# Altium schematic sheet 03_Power_260316_V02.SchDoc
size A3
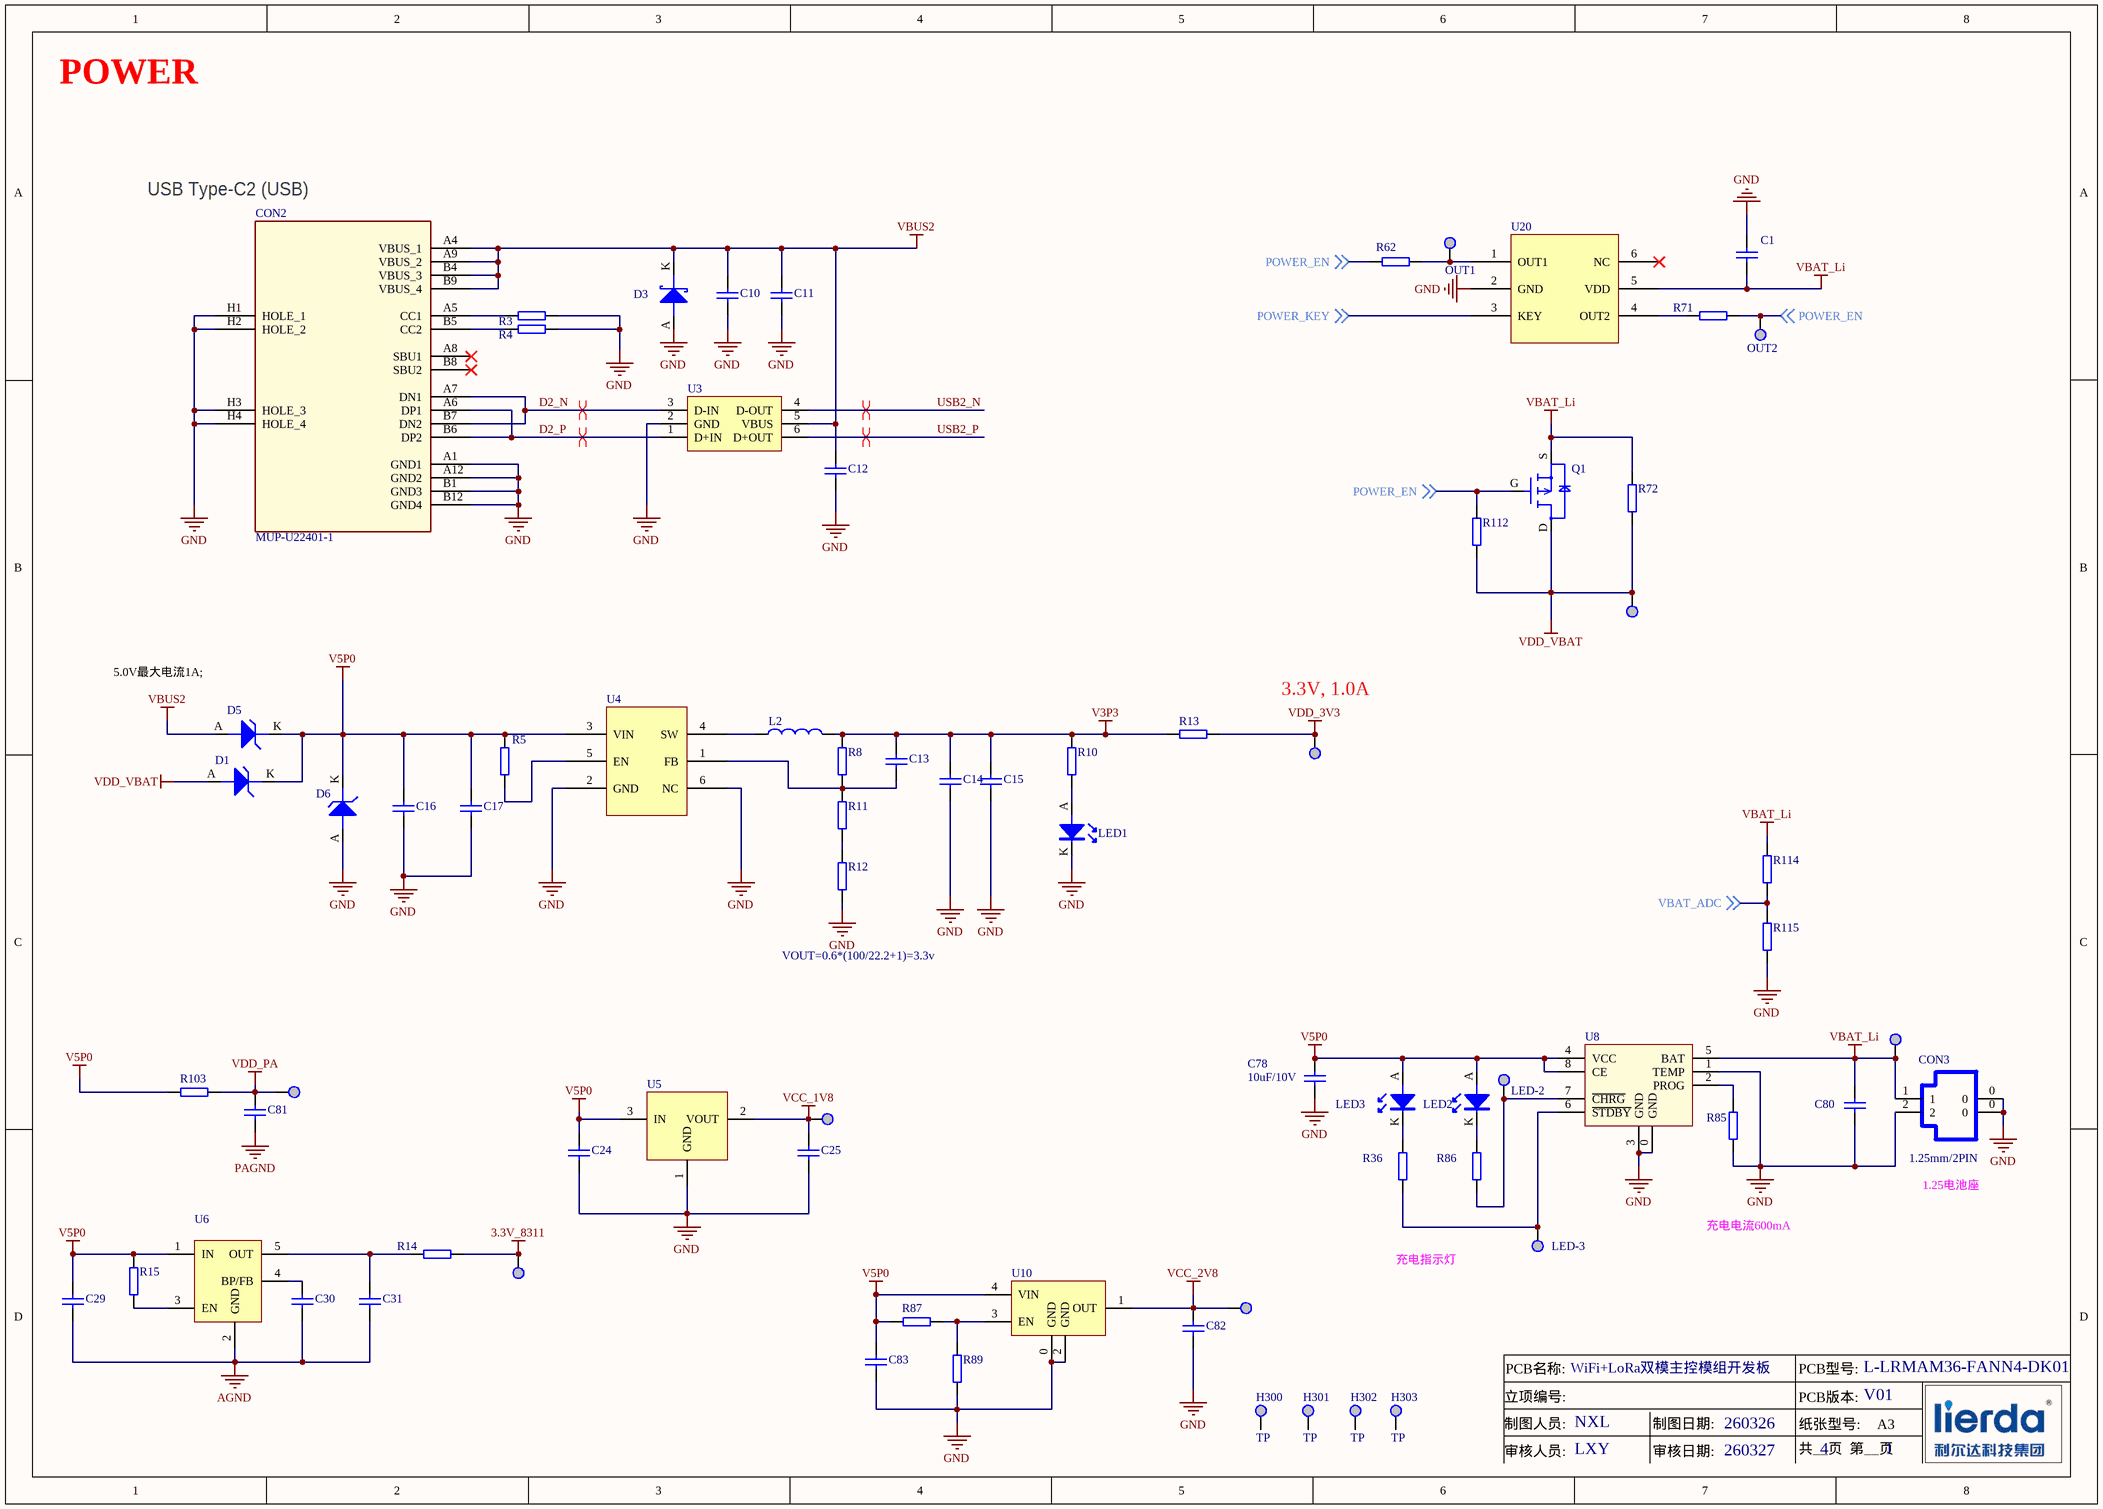
[diagram p0: 03_Power_260316_V02.SchDoc]

## Parts
C1  2.2uF  [0402C_0.4D]  (value not drawn)
C10  4.7uF/16V  [0402C_0.4D]  (value not drawn)
C11  0.1uF/16V  [0402C_0.4D]  (value not drawn)
C12  0.1uF  [0402C_0.4D]  (value not drawn)
C13  20pF  [0402C_0.4D]  (value not drawn)
C14  22uF  [0603C_0.6D]  (value not drawn)
C15  10uF/10V  [0402C_0.4D]  (value not drawn)
C16  4.7uF/16V  [0402C_0.4D]  (value not drawn)
C17  1uF/16V  [0402C_0.4D]  (value not drawn)
C24  1uF/16V  [0402C_0.4D]  (value not drawn)
C25  1uF/16V  [0402C_0.4D]  (value not drawn)
C29  1uF/16V  [0402C_0.4D]  (value not drawn)
C30  10nF  [0402C_0.4D]  (value not drawn)
C31  1uF/16V  [0402C_0.4D]  (value not drawn)
C78  产品型号: 10uF/10V  [0402C_0.4D]  (hidden comment: CAP-NP)
C80  CAP-NP  [0402C_0.4D]  (value not drawn)
C81  10uF/10V  [0402C_0.4D]  (value not drawn)
C82  1uF/16V  [0402C_0.4D]  (value not drawn)
C83  2.2uF  [0402C_0.4D]  (value not drawn)
CON2  产品型号: MUP-U22401-1  [USB-TYPEC-U22401-1]  (hidden comment: USB-TYPE C-16)
CON3  FPC-2  [SMD-1.25-2P]  (value not drawn)
D1  DIODE-ZD  [SOD-123-FL]  (value not drawn)
D3  DIODE-TVS  [UDFN2(1610)]  (value not drawn)
D5  DIODE-ZD  [SOD-123-FL]  (value not drawn)
D6  DIODE-ZD  [SOD-123]  (value not drawn)
H300  TP  [M2.5]
H301  TP  [M2.5]
H302  TP  [M2.5]
H303  TP  [M2.5]
L2  2.2uH/20%/2.0*1.2*0.8/1.7A/146mΩ  [0805L_0.7D-NB]  (value not drawn)
LED1  *  [D0603]  (value not drawn)
LED2  红/25mA  [D0603]  (value not drawn)
LED3  绿/25mA  [D0603]  (value not drawn)
LED-2  MARK  [TEST]  (value not drawn)
LED-3  MARK  [TEST]  (value not drawn)
OUT1  MARK  [TEST]  (value not drawn)
OUT2  MARK  [TEST]  (value not drawn)
Q1  P-MOS-D1  [SOT-23-3G]  (value not drawn)
R3  5.1K/1%  [0402R_0.4D]  (value not drawn)
R4  5.1K/1%  [0402R_0.4D]  (value not drawn)
R5  51KΩ/1%  [0402R_0.4D]  (value not drawn)
R8  100KΩ/1%  [0402R_0.4D]  (value not drawn)
R10  620R  [0402R_0.4D]  (value not drawn)
R11  22KΩ  [0402R_0.4D]  (value not drawn)
R12  220Ω/1%  [0402R_0.4D]  (value not drawn)
R13  RES  [0805R_0.6D]  (value not drawn)
R14  0Ω/1%  [0402R_0.4D]  (value not drawn)
R15  10KΩ/5%  [0402R_0.4D]  (value not drawn)
R36  RES  [0402R_0.4D]  (value not drawn)
R62  0Ω/1%  [0402R_0.4D]  (value not drawn)
R71  0Ω/1%  [0402R_0.4D]  (value not drawn)
R72  RES  [0805R_0.6D]  (value not drawn)
R85  RES  [0402R_0.4D]  (value not drawn)
R86  RES  [0402R_0.4D]  (value not drawn)
R87  10KΩ/5%  [0402R_0.4D]  (value not drawn)
R89  10KΩ/5%  [0402R_0.4D]  (value not drawn)
R103  RES  [0805R_0.6D]  (value not drawn)
R112  NC  [0402R_0.4D]  (value not drawn)
R114  1MΩ/1%  [0402R_0.4D]  (value not drawn)
R115  1MΩ/1%  [0402R_0.4D]  (value not drawn)
TP_LDO1  TP  [TEST]  (value not drawn)
TP_VBAT1  TP  [TEST]  (value not drawn)
U3  USBLC6-2SC6  [SOT-23-6P]  (value not drawn)
U4  SGM61020XKB6G/TR  [SOT-563-6]  (value not drawn)
U5  LDO-1G2OUT3IN  [SOT-23-3P]  (value not drawn)
U6  SGM2028-XYN5G/TR  [SOT-23-5P]  (value not drawn)
U8  TP4056  [SOP-8(1.27)-GND]  (value not drawn)
U10  ETA5053V280DF1E  [XDFN4-1X1]  (value not drawn)
U20  EC190708-4-A427  [SOT-23-6P]  (value not drawn)
VDD_1V8  MARK  [TEST]  (value not drawn)
VDD_2V8  MARK  [TEST]  (value not drawn)
VDD_PA  MARK  [TEST]  (value not drawn)
VDD_VBAT  MARK  [TEST]  (value not drawn)
VDD_WiFi  MARK  [TEST]  (value not drawn)

## Nets
3.3V_8311: R14.2 TP_LDO1.1
AGND: C29.1 C30.1 C31.1 U6.2(GND)
GND: C1.1 C10.1 C11.1 C12.1 C14.1 C15.1 C16.1 C17.1 C24.1 C25.1 C78.1 C80.1 C82.1 C83.1 CON2.A1(GND1) CON2.A12(GND2) CON2.B1(GND3) CON2.B12(GND4) CON2.H1(HOLE_1) CON2.H2(HOLE_2) CON2.H3(HOLE_3) CON2.H4(HOLE_4) CON3.0 CON3.2 D3.A D6.A LED1.K R3.1 R4.1 R12.1 R85.1 R89.1 R115.1 U3.2(GND) U4.2(GND) U4.6(NC) U5.1(GND) U8.0(GND) U8.1(TEMP) U8.3(GND) U10.0(GND) U10.2(GND) U20.2(GND)
PAGND: C81.1
V3P3: C13.2 C14.2 C15.2 L2.2 R8.2 R10.2 R13.2
V5P0: C16.2 C17.2 C24.2 C29.2 C78.2 C83.2 D1.K D5.K D6.K LED2.A LED3.A R5.2 R15.2 R87.2 R103.2 U4.3(VIN) U5.3(IN) U6.1(IN) U8.4(VCC) U8.8(CE) U10.4(VIN)
VBAT_Li: C1.2 C80.2 CON3.1 Q1.S R72.1 R114.2 TP_VBAT1.1 U8.5(BAT) U20.5(VDD)
VBUS2: C10.2 C11.2 C12.2 CON2.A4(VBUS_1) CON2.A9(VBUS_2) CON2.B4(VBUS_3) CON2.B9(VBUS_4) D3.K D5.A U3.5(VBUS)
VCC_1V8: C25.2 U5.2(VOUT) VDD_1V8.1
VCC_2V8: C82.2 U10.1(OUT) VDD_2V8.1
VDD_3V3: R13.1 VDD_WiFi.1
VDD_PA: C81.2 R103.1 VDD_PA.1
VDD_VBAT: D1.A Q1.D R72.2 R112.1 VDD_VBAT.1
D2_N: CON2.A7(DN1) CON2.B7(DN2) U3.3(D-IN)
D2_P: CON2.A6(DP1) CON2.B6(DP2) U3.1(D+IN)
POWER_EN: OUT2.1 Q1.G R62.1 R71.2 R112.2 ; off-sheet POWER_EN
POWER_KEY: U20.3(KEY) ; off-sheet POWER_KEY
USB2_N: U3.4(D-OUT)
USB2_P: U3.6(D+OUT)
VBAT_ADC: R114.1 R115.2 ; off-sheet VBAT_ADC
NetC13_1: C13.1 R8.1 R11.2 U4.1(FB)
NetC30_2: C30.2 U6.4(BP/FB)
NetC31_2: C31.2 R14.1 U6.5(OUT)
NetCON2_A5: CON2.A5(CC1) R3.2
NetCON2_B5: CON2.B5(CC2) R4.2
NetL2_1: L2.1 U4.4(SW)
NetLED1_A: LED1.A R10.1
NetLED2_K: LED2.K R86.2
NetLED3_K: LED3.K R36.2
NetLED-2_1: LED-2.1 R86.1 U8.7(~{CHRG})
NetLED-3_1: LED-3.1 R36.1 U8.6(~{STDBY})
NetOUT1_1: OUT1.1 R62.2 U20.1(OUT1)
NetR5_1: R5.1 U4.5(EN)
NetR11_1: R11.1 R12.2
NetR15_1: R15.1 U6.3(EN)
NetR71_1: R71.1 U20.4(OUT2)
NetR85_2: R85.2 U8.2(PROG)
NetR87_1: R87.1 R89.2 U10.3(EN)

Not connected (* = marked no-connect by the designer): CON2 A8(SBU1)* B8(SBU2)*; H300 1; H301 1; H302 1; H303 1; U20 6(NC)*

## Layout directives
differential pair: D2_N, D2_P, USB2_N, USB2_P

## Notes on the sheet
- POWER
- (near CON2) USB Type-C2 (USB)
- 5.0V最大电流1A;
- (near VDD_WiFi) 3.3V, 1.0A
- VOUT=0.6*(100/22.2+1)=3.3v
- 1.25电池座
- 充电指示灯
- 充电电流600mA
- PCB名称:
- WiFi+LoRa双模主控模组开发板
- PCB型号:
- L-LRMAM36-FANN4-DK01
- 制图人员:
- 审核人员:
- 立项编号:
- NXL
- LXY
- 制图日期:
- 审核日期:
- 260326
- 260327
- 纸张型号:
- 共__页  第__页
- PCB版本:
- 4
- V01
- A3
- 1

## Library data of the parts
C1 C16 C83 = 1405002483: 4.7uF/16V/20%/X5R; 产品型号: CL05A475MO5NUNC; 品名: 陶瓷电容; 原厂品牌: SAMSUNG电容; 封装: 0402; 存货编码: 1405002483
C10 = 1405002483: 4.7uF/16V/20%/X5R; 产品型号: CL05A475MO5NUNC; 器件名称: 陶瓷电容; 原厂品牌: SAMSUNG电容; 封装: 0402; 存货编码: 1405002483
C11 = 1405000464: 0.1uF/16V/10%/X7R; 产品型号: CL05B104KO5NNNC; 品名: 陶瓷电容; 原厂品牌: SAMSUNG; 封装: 0402; 物料状态: 优选; 存货编码: 1405000464
C12 = 1405000041: 0.1uF/16V/10%/X7R; 产品型号: CC0402KRX7R7BB104; 器件名称: 陶瓷电容; 原厂品牌: YAGEO; 封装: 0402; 存货编码: 1405000041
C13 = 1405001560: 20pF/50V/5%/C0G; 产品型号: V200J0402C0G500NBT; 品名: 陶瓷电容; 原厂品牌: 微容VIIYONG; 封装: 0402; 物料状态: 优选; 存货编码: 1405001560
C14 = 1405001346: 22uF/10V/20%/X5R; 产品型号: CL10A226MP8NUN#; 品名: 陶瓷电容; 原厂品牌: SAMSUNG电容; 封装: 0603; 存货编码: 1405001346
C15 C81 = 1405001308: 10uF/10V/20%/X5R; 产品型号: CL05A106MP5NUNC; 品名: 陶瓷电容; 原厂品牌: SAMSUNG电容; 封装: 0402; 存货编码: 1405001308
C17 C24 C25 C29 C31 C82 = 1405004038: 1uF/16V/10%/X5R; 产品型号: CL05A105KO5NNNC; 品名: 陶瓷电容; 原厂品牌: SAMSUNG电容; 封装: 0402; 存货编码: 1405004038
C30 = 1405005232: 10nF/16V/10%/X7R; 产品型号: V103K0402X7R160NBT; 品名: 陶瓷电容; 原厂品牌: 微容VIIYONG; 封装: 0402; 物料状态: 优选; 存货编码: 1405005232
C78 C80 = 1405001308: 10uF/10V/20%/X5R; 品名: 陶瓷电容; 原厂品牌: 三星; 封装: 0402; 物料状态: 优选; 存货编码: 1405001308
  C80: 产品型号: 10uF/10V
CON2 = 1416004328: TYPE C; 品名: USB连接器; 原厂品牌: 德海威; 封装: SMD; 物料状态: 优选; 存货编码: 1416004328
CON3 = 1416001814: 1.25mm/2PIN; 品名: 线对板连接器; 原厂品牌: 肯耐特; 封装: SMD; 物料状态: 优选; 产品型号: 1.25mm/2PIN; 存货编码: 1416001814
D1 D5 = 1409001653: 40V/3A; 产品型号: S34; 品名: 肖特基二极管; 原厂品牌: YJ; 封装: SOD-123FL; 物料状态: 优选; 存货编码: 1409001653
D3 = 1409004319: 1通道; 产品型号: WS6.3DPX; 品名: ESD保护器件; 原厂品牌: WAYON（维安）; 封装: DFN1610-2L; 物料状态: 优选; 存货编码: 1409004319
D6 = 1409000809: 5.6V/0.5W; 产品型号: LBZT52C5V6T1G; 品名: 稳压二极管; 原厂品牌: LRC; 物料状态: 优选; 存货编码: 1409000809; 封装: SOD-123
L2 = 1404002926: 产品型号: SKFB201208PA2R2M; 品名: 功率电感; 原厂品牌: 三体Scientic; 封装: 0805; 物料状态: 试用; 存货编码: 1404002926
LED1 = 1409000426: 红/25mA; 产品型号: 19-213SURC-S530-A2-TR8; 器件名称: 发光二极管; 原厂品牌: EVERLIGHT; 封装: 0603; 存货编码: 1409000426
LED2 LED3 = 1409000351: 绿/25mA/112-285mcd; 产品型号: 19-217/GHC-YR1S2/6T; 品名: LED发光二极管; 原厂品牌: EVERLIGHT; 封装: 0603; 物料状态: 优选; 存货编码: 1409000351
Q1 = 1412000739: PMOS/30V/4.2A; 产品型号: CJ3401; 品名: MOS管; 原厂品牌: CJ; 封装: SOT-23; 物料状态: 优选; 存货编码: 1412000739
R3 R4 = 1408001245: 5.1K/1%/100PPM; 产品型号: RC0402FR-075K1L; 品名: 厚膜贴片电阻; 原厂品牌: YAGEO; 封装: 0402; 存货编码: 1408001245
R5 = 1408001200: 产品型号: 0402WGF5102TCE; 品名: 厚膜贴片电阻; 原厂品牌: Uniohm; 封装: 0402; 物料状态: 优选; 存货编码: 1408001200
R8 = 1408000126: 产品型号: 0402WGF1003TCE; 品名: 厚膜贴片电阻; 原厂品牌: Uniohm; 封装: 0402; 物料状态: 优选; 存货编码: 1408000126
R10 = 1408006136: 620R/5%; 产品型号: 0402WGJ0621TCE; 品名: 厚膜贴片电阻; 原厂品牌: Uniohm; 封装: 0402; 物料状态: 限用; 存货编码: 1408006136
R11 R112 = 1408000783: 22KΩ/1%; 产品型号: 0402WGF2202TCE; 品名: 厚膜贴片电阻; 原厂品牌: Uniohm; 封装: 0402; 物料状态: 优选; 存货编码: 1408000783
R12 = 1408001062: 产品型号: RC0402FR-07220RL; 品名: 厚膜贴片电阻; 原厂品牌: YAGEO; 封装: 0402; 物料状态: 优选; 存货编码: 1408001062
R13 R72 = 1408000487: 0Ω/1%; 产品型号: 0R; 品名: 厚膜贴片电阻; 原厂品牌: Uniohm; 封装: 0805; 物料状态: 优选; 存货编码: 1408000487
R14 R62 R71 = 1408000124: 产品型号: 0402WGF0000TCE; 品名: 厚膜贴片电阻; 原厂品牌: Uniohm; 封装: 0402; 物料状态: 优选; 存货编码: 1408000124
R15 R87 R89 = 1408000526: 产品型号: 0402WGJ0103TCE; 品名: 厚膜贴片电阻; 原厂品牌: Uniohm; 封装: 0402; 物料状态: 优选; 存货编码: 1408000526
R36 R86 = 1408000535: 1KΩ/5%; 产品型号: 620R; 品名: 厚膜贴片电阻; 原厂品牌: Uniohm; 封装: 0402; 物料状态: 优选; 存货编码: 1408000535
R85 = 1408000223: 2KΩ/5%; 产品型号: 2K; 品名: 厚膜贴片电阻; 原厂品牌: Uniohm; 封装: 0402; 物料状态: 优选; 存货编码: 1408000223
R103 = 1408000487: 0Ω/1%; 品名: 厚膜贴片电阻; 原厂品牌: Uniohm; 封装: 0805; 物料状态: 优选; 存货编码: 1408000487
R114 R115 = 1408000713: 产品型号: 0402WGF1004TCE; 品名: 厚膜贴片电阻; 原厂品牌: Uniohm; 封装: 0402; 物料状态: 优选; 存货编码: 1408000713
U3 = 1410003301: USB保护芯片; 品名: ESD保护二极管; 原厂品牌: ST; 封装: SOT-23-6; 产品型号: USBLC6-2SC6; 存货编码: 1410003301
U5 = 1407003557: 1.8V/250mA/1.7-7.5V; 产品型号: SGM2034-1.8YN3G/TR; 品名: 低压差线性稳压器; 原厂品牌: 圣邦微; 封装: SOT-23-3; 物料状态: 优选; 存货编码: 1407003557
U6 = 1407001780: 3.3V/500mA/2.5-5.5V; 产品型号: SGM2028-3.3YN5G/TR; 品名: 低压差线性稳压器; 原厂品牌: SGMICRO; 封装: SOT-23-5; 物料状态: 优选; 存货编码: 1407001780
U8 = 1407000458: -/1A; 品名: 电池管理IC; 原厂品牌: 南京拓微; 封装: SOP8; 物料状态: 优选; 产品型号: TP4056; 存货编码: 1407000458
U10 = 1407004220: 2.8V/300mA/1.6-6V; 品名: 低压差线性稳压器; 原厂品牌: 钰泰科技; 封装: DFN4; 物料状态: 优选; 产品型号: ETA5053V280DF1E; 存货编码: 1407004220
H300-H303 TP_LDO1 TP_VBAT1 = TP: 产品型号: TP